# Altium schematic sheet Sh1.SchDoc
size A4; SheetNumber: 1; SheetTotal: 1
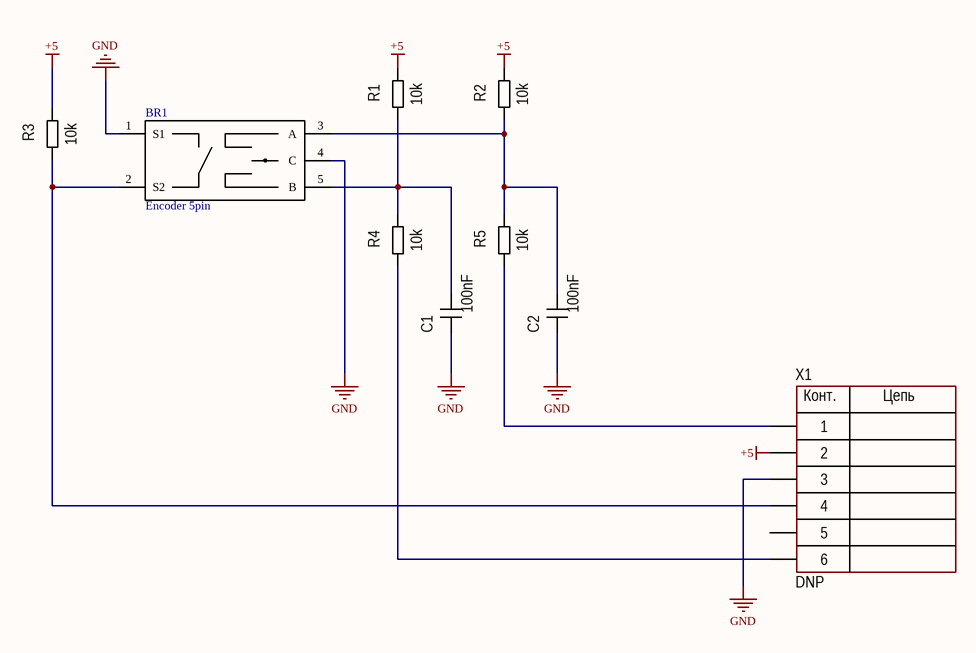
[diagram p0: Sh1.SchDoc]

## Parts
BR1  Encoder 5pin  [Enc-5pin]
C1  100nF  [CH0603C]
C2  100nF  [CH0603C]
R1  10k  [CH0603R]
R2  10k  [CH0603R]
R3  10k  [CH0603R]
R4  10k  [CH0603R]
R5  10k  [CH0603R]
X1  DNP  [CON: PBD-6]

## Nets
+5: R1.2 R2.2 R3.2 X1.2
GND: BR1.1(S1) BR1.4(C) C1.1 C2.1 X1.3
NetBR1_2: BR1.2(S2) R3.1 X1.4
NetBR1_3: BR1.3(A) C2.2 R2.1 R5.2
NetBR1_5: BR1.5(B) C1.2 R1.1 R4.2
NetR4_1: R4.1 X1.6
NetR5_1: R5.1 X1.1

Not connected (* = marked no-connect by the designer): X1 5

## Notes on the sheet
- (in symbol 6-Connector) Конт.; Цепь

## Library data of the parts
BR1 = Encoder 5pin: Model: EC-11
C1 C2 = Capacitor: Model: 06035C104JAT2A; Manufacturer: *; HelpURL: *; ComponentKind: *; Value: 100nF
R1-R5 = Resistor: Model: CR0603-FX-1002ELF; Manufacturer: *; HelpURL: *; ComponentKind: *; Value: 10k
X1 = 6-Connector: Model: DNP; Manufacturer: *; HelpURL: *; ComponentKind: *